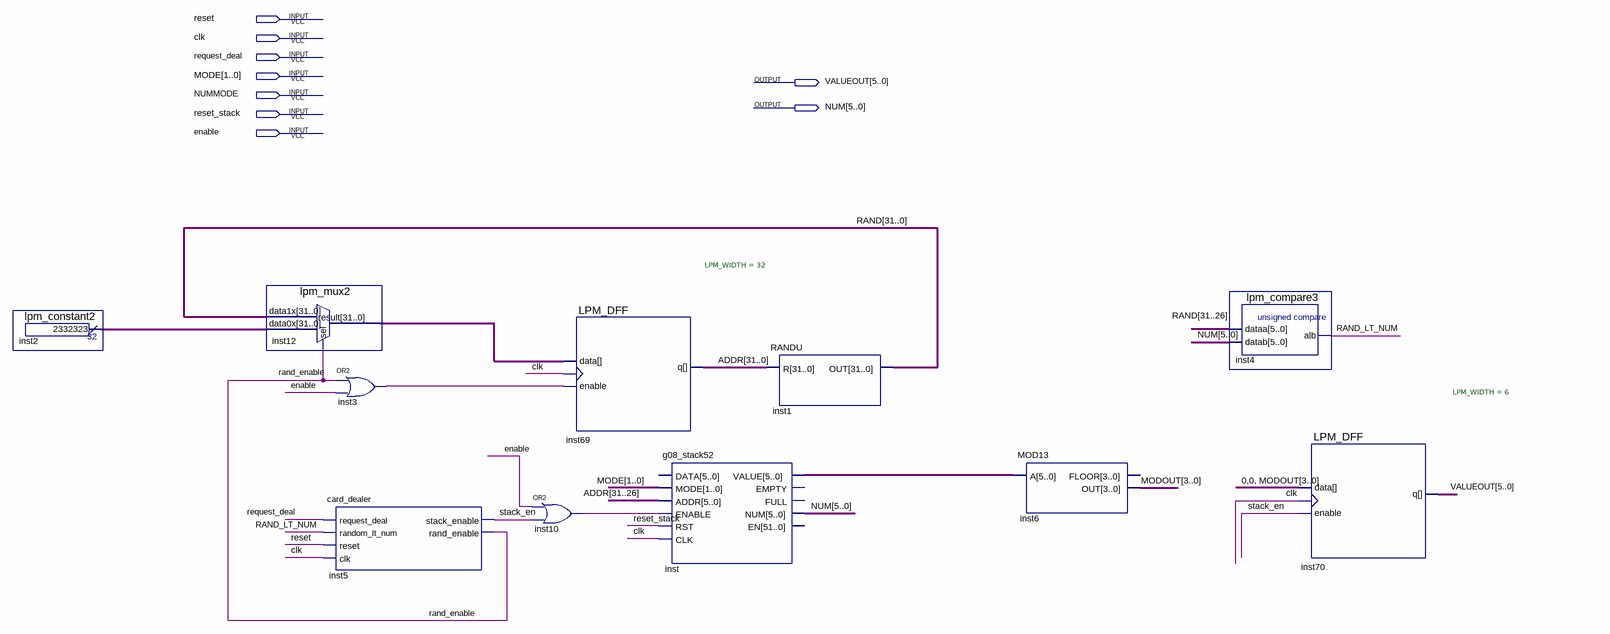
[diagram p0: schematic sheet]
// Quartus schematic test_bed_lab4.bdf as structural Verilog: 11 symbols, 9 pins
module test_bed_lab4 (
  input  reset,
  input  clk,
  input  request_deal,
  input  [1:0] MODE,
  input  NUMMODE,
  input  reset_stack,
  input  enable,
  output [5:0] VALUEOUT,
  output [5:0] NUM
);

  wire \0 , inst3_out, inst10_out, rand_enable, RAND_LT_NUM, stack_en;
  wire [3:0] MODOUT;
  wire [5:0] inst_value;
  wire [31:0] ADDR, inst2_result, inst12_result, RAND;

  lpm_constant2 inst2 (.result(inst2_result));
  lpm_mux2 inst12 (.data1x(RAND), .data0x(inst2_result), .sel(rand_enable), .result(inst12_result));
  or inst3 (inst3_out, rand_enable, enable);
  card_dealer inst5 (
    .request_deal(request_deal), .random_lt_num(RAND_LT_NUM), .reset(reset), .clk(clk),
    .stack_enable(stack_en), .rand_enable(rand_enable));
  or inst10 (inst10_out, enable, stack_en);
  LPM_DFF #(.LPM_WIDTH(32)) inst69 (.enable(inst3_out), .clock(clk), .data(inst12_result), .q(ADDR));
  g08_stack52 inst (
    .MODE(MODE), .ADDR(ADDR[31:26]), .ENABLE(inst10_out), .RST(reset_stack), .CLK(clk), .VALUE(inst_value),
    .NUM(NUM));  // open: DATA, EMPTY, FULL, EN
  RANDU inst1 (.R(ADDR), .OUT(RAND));
  MOD13 inst6 (.A(inst_value), .OUT(MODOUT));  // open: FLOOR
  lpm_compare3 inst4 (.dataa(RAND[31:26]), .datab(NUM), .alb(RAND_LT_NUM));
  LPM_DFF #(.LPM_WIDTH(6)) inst70 (.enable(stack_en), .clock(clk), .data({{2{\0 }}, MODOUT}), .q(VALUEOUT));
endmodule
